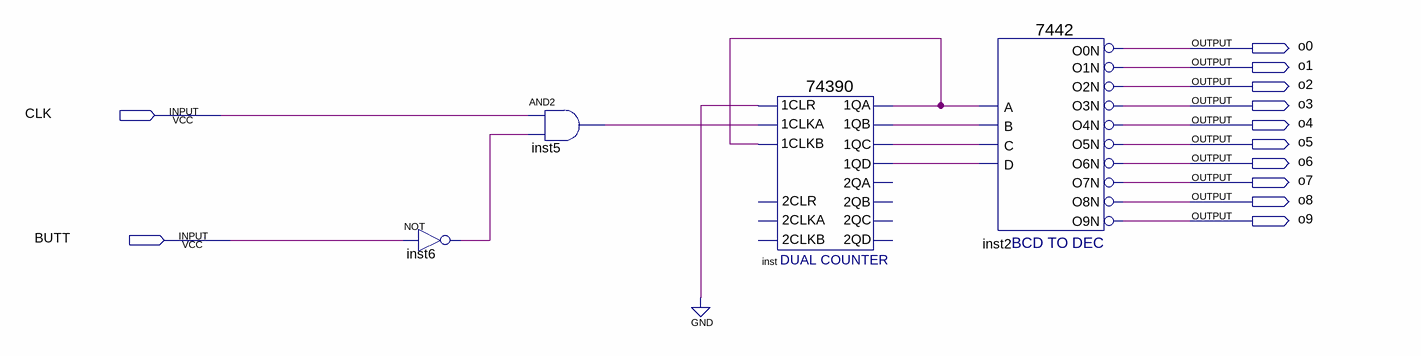
[diagram p0: schematic sheet]
// Quartus schematic P1041217.bdf as structural Verilog: 4 symbols, 12 pins
module P1041217 (
  input  CLK,
  input  BUTT,
  output o0,
  output o1,
  output o2,
  output o3,
  output o4,
  output o5,
  output o6,
  output o7,
  output o8,
  output o9
);

  wire inst5_out, inst6_out, inst_1qa, inst_1qb, inst_1qc, inst_1qd;

  not inst6 (inst6_out, BUTT);
  and inst5 (inst5_out, CLK, inst6_out);
  \74390  inst (
    .\1CLR (1'b0), .\1CLKA (inst5_out), .\1CLKB (inst_1qa), .\1QA (inst_1qa), .\1QB (inst_1qb),
    .\1QC (inst_1qc), .\1QD (inst_1qd));  // open: 2CLKA, 2CLR, 2CLKB, 2QA, 2QB, 2QC, 2QD
  \7442  inst2 (
    .D(inst_1qd), .B(inst_1qb), .C(inst_1qc), .A(inst_1qa), .O7N(o7), .O8N(o8), .O9N(o9), .O0N(o0), .O3N(o3),
    .O2N(o2), .O1N(o1), .O6N(o6), .O5N(o5), .O4N(o4));
endmodule
